# EAGLE design VNH7070AS test PCB (EAGLE 9.5.2)
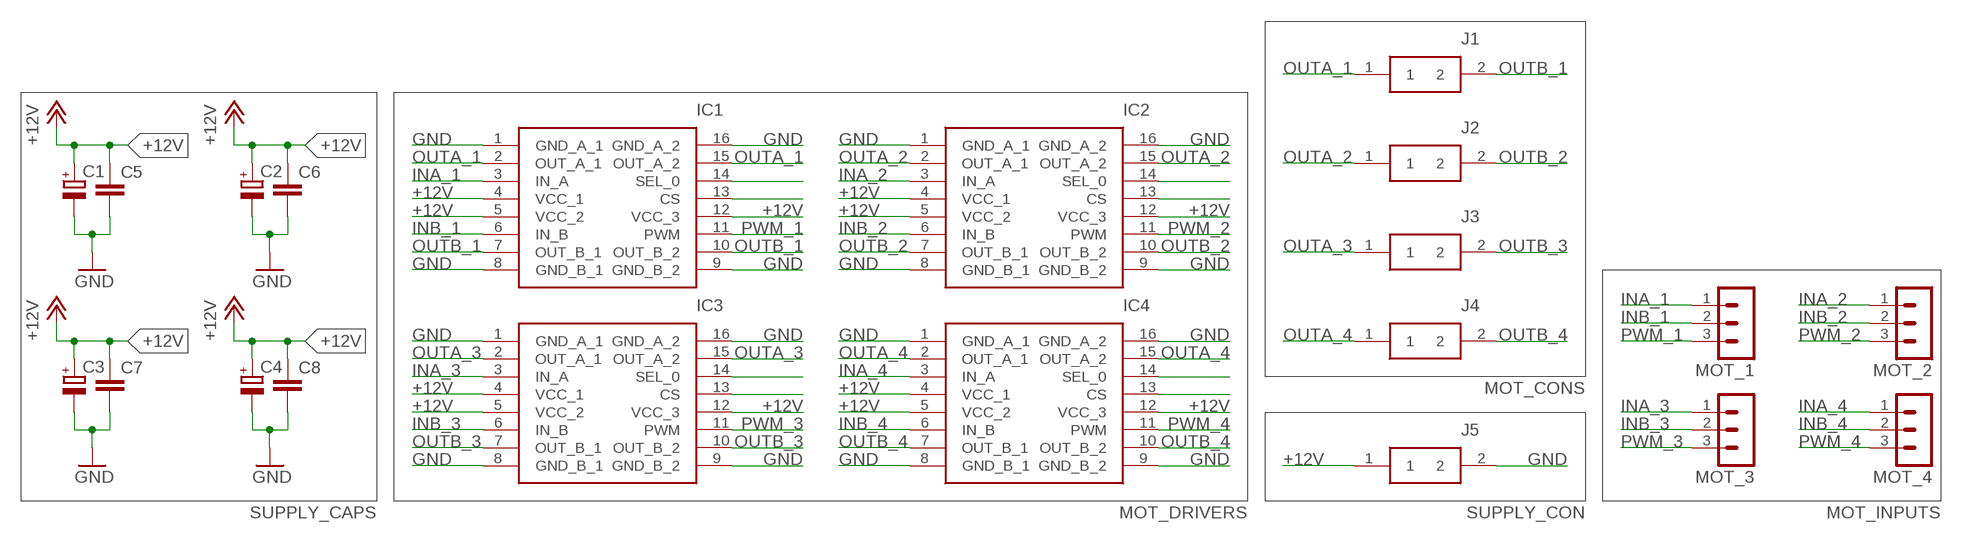
[diagram p0: schematic, sheet 1]

## Parts
C1  220uF  CPOL-EUE3.5-8  [E3,5-8]
C2  220uF  CPOL-EUE3.5-8  [E3,5-8]
C3  220uF  CPOL-EUE3.5-8  [E3,5-8]
C4  220uF  CPOL-EUE3.5-8  [E3,5-8]
C5  100nF  C-EUC1206  [C1206]
C6  100nF  C-EUC1206  [C1206]
C7  100nF  C-EUC1206  [C1206]
C8  100nF  C-EUC1206  [C1206]
IC1  VNH7070ASTR  [SOIC127P600X175-16N]
IC2  VNH7070ASTR  [SOIC127P600X175-16N]
IC3  VNH7070ASTR  [SOIC127P600X175-16N]
IC4  VNH7070ASTR  [SOIC127P600X175-16N]
J1  70553-0001  [SHDRRA2W109P0_254_1X2_762X1359]
J2  70553-0001  [SHDRRA2W109P0_254_1X2_762X1359]
J3  70553-0001  [SHDRRA2W109P0_254_1X2_762X1359]
J4  70553-0001  [SHDRRA2W109P0_254_1X2_762X1359]
J5  70553-0001  [SHDRRA2W109P0_254_1X2_762X1359]
MOT_1  MA03-1  [MA03-1]
MOT_2  MA03-1  [MA03-1]
MOT_3  MA03-1  [MA03-1]
MOT_4  MA03-1  [MA03-1]

## Nets
+12V: C1.+ C2.+ C3.+ C4.+ C5.1 C6.1 C7.1 C8.1 IC1.4(VCC_1) IC1.5(VCC_2) IC1.12(VCC_3) IC2.4(VCC_1) IC2.5(VCC_2) IC2.12(VCC_3) IC3.4(VCC_1) IC3.5(VCC_2) IC3.12(VCC_3) IC4.4(VCC_1) IC4.5(VCC_2) IC4.12(VCC_3) J5.1
GND: C1.- C2.- C3.- C4.- C5.2 C6.2 C7.2 C8.2 IC1.1(GND_A_1) IC1.8(GND_B_1) IC1.9(GND_B_2) IC1.16(GND_A_2) IC2.1(GND_A_1) IC2.8(GND_B_1) IC2.9(GND_B_2) IC2.16(GND_A_2) IC3.1(GND_A_1) IC3.8(GND_B_1) IC3.9(GND_B_2) IC3.16(GND_A_2) IC4.1(GND_A_1) IC4.8(GND_B_1) IC4.9(GND_B_2) IC4.16(GND_A_2) J5.2
INA_1: IC1.3(IN_A) MOT_1.1
INA_2: IC2.3(IN_A) MOT_2.1
INA_3: IC3.3(IN_A) MOT_3.1
INA_4: IC4.3(IN_A) MOT_4.1
INB_1: IC1.6(IN_B) MOT_1.2
INB_2: IC2.6(IN_B) MOT_2.2
INB_3: IC3.6(IN_B) MOT_3.2
INB_4: IC4.6(IN_B) MOT_4.2
N$1: IC1.14(SEL_0)
N$2: IC1.13(CS)
N$3: IC2.14(SEL_0)
N$4: IC2.13(CS)
N$5: IC3.14(SEL_0)
N$6: IC3.13(CS)
N$7: IC4.14(SEL_0)
N$8: IC4.13(CS)
OUTA_1: IC1.2(OUT_A_1) IC1.15(OUT_A_2) J1.1
OUTA_2: IC2.2(OUT_A_1) IC2.15(OUT_A_2) J2.1
OUTA_3: IC3.2(OUT_A_1) IC3.15(OUT_A_2) J3.1
OUTA_4: IC4.2(OUT_A_1) IC4.15(OUT_A_2) J4.1
OUTB_1: IC1.7(OUT_B_1) IC1.10(OUT_B_2) J1.2
OUTB_2: IC2.7(OUT_B_1) IC2.10(OUT_B_2) J2.2
OUTB_3: IC3.7(OUT_B_1) IC3.10(OUT_B_2) J3.2
OUTB_4: IC4.7(OUT_B_1) IC4.10(OUT_B_2) J4.2
PWM_1: IC1.11(PWM) MOT_1.3
PWM_2: IC2.11(PWM) MOT_2.3
PWM_3: IC3.11(PWM) MOT_3.3
PWM_4: IC4.11(PWM) MOT_4.3

## Notes on the sheet
- MOT_CONS
- SUPPLY_CAPS | MOT_DRIVERS | SUPPLY_CON | MOT_INPUTS

## Library data of the parts
C1-C4 = rcl:CPOL-EU: POLARIZED CAPACITOR, European symbol; SPICEPREFIX: C
C5-C8 = rcl:C-EU: CAPACITOR, European symbol; SPICEPREFIX: C
IC1-IC4 = VNH7070AS:VNH7070ASTR: Motor / Motion / Ignition Controllers & Drivers Source: Datasheet <http://www.st.com/content/ccc/resource/technical/document/datasheet/08/97/0a/0c/cf/4b/41/40/DM00213876.pdf/files/DM00213876.pdf/jcr:content/translations/en.DM00213876.pdf>; DESCRIPTION: Motor / Motion / Ignition Controllers & Drivers; HEIGHT: 1.75mm; MANUFACTURER_NAME: STMicroelectronics; MANUFACTURER_PART_NUMBER: VNH7070ASTR; MOUSER_PART_NUMBER: 511-VNH7070ASTR; MOUSER_PRICE-STOCK: https://www.mouser.com/Search/Refine.aspx?Keyword=511-VNH7070ASTR; RS_PART_NUMBER: 1647017P; RS_PRICE-STOCK: http://uk.rs-online.com/web/p/products/1647017P
J1-J5 = Molex 2pin SL:70553-0001: 2.54mm,housing,Cgrid,shrouded,90??,2w Molex SL Series, Series Number 70553, 2.54mm Pitch 2 Way 1 Row Right Angle PCB Header, Solder Termination, 3A Source: Datasheet <http://docs-emea.rs-online.com/webdocs/13c4/0900766b813c4970.pdf>; DESCRIPTION: 2.54mm,housing,Cgrid,shrouded,90??,2w Molex SL Series, Series Number 70553, 2.54mm Pitch 2 Way 1 Row Right Angle PCB Header, Solder Termination, 3A; HEIGHT: 6.99mm; MANUFACTURER_NAME: Molex; MANUFACTURER_PART_NUMBER: 70553-0001; MOUSER_PART_NUMBER: 538-70553-0001; MOUSER_PRICE-STOCK: https://www.mouser.com/Search/Refine.aspx?Keyword=538-70553-0001; RS_PART_NUMBER: 6792516P; RS_PRICE-STOCK: http://uk.rs-online.com/web/p/products/6792516P
MOT_1-MOT_4 = con-lstb:MA03-1: PIN HEADER; OC_FARNELL: unknown; OC_NEWARK: unknown

## Board
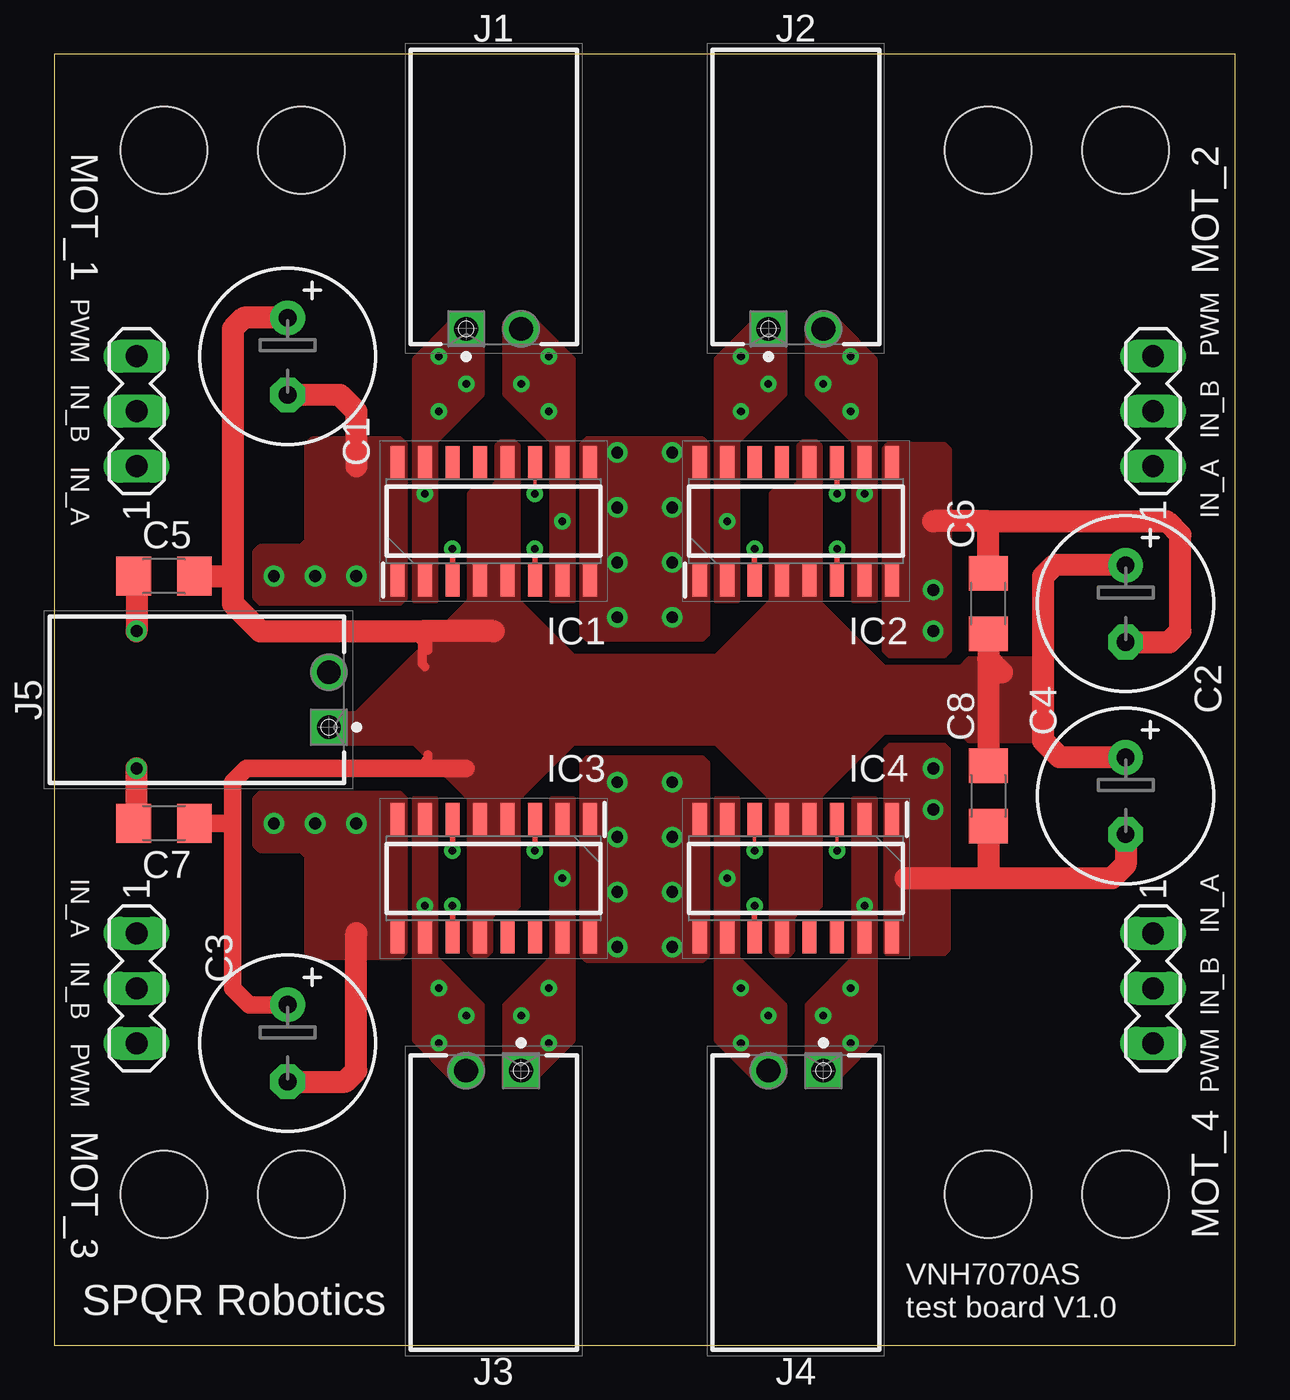
[diagram p1: board, top side]
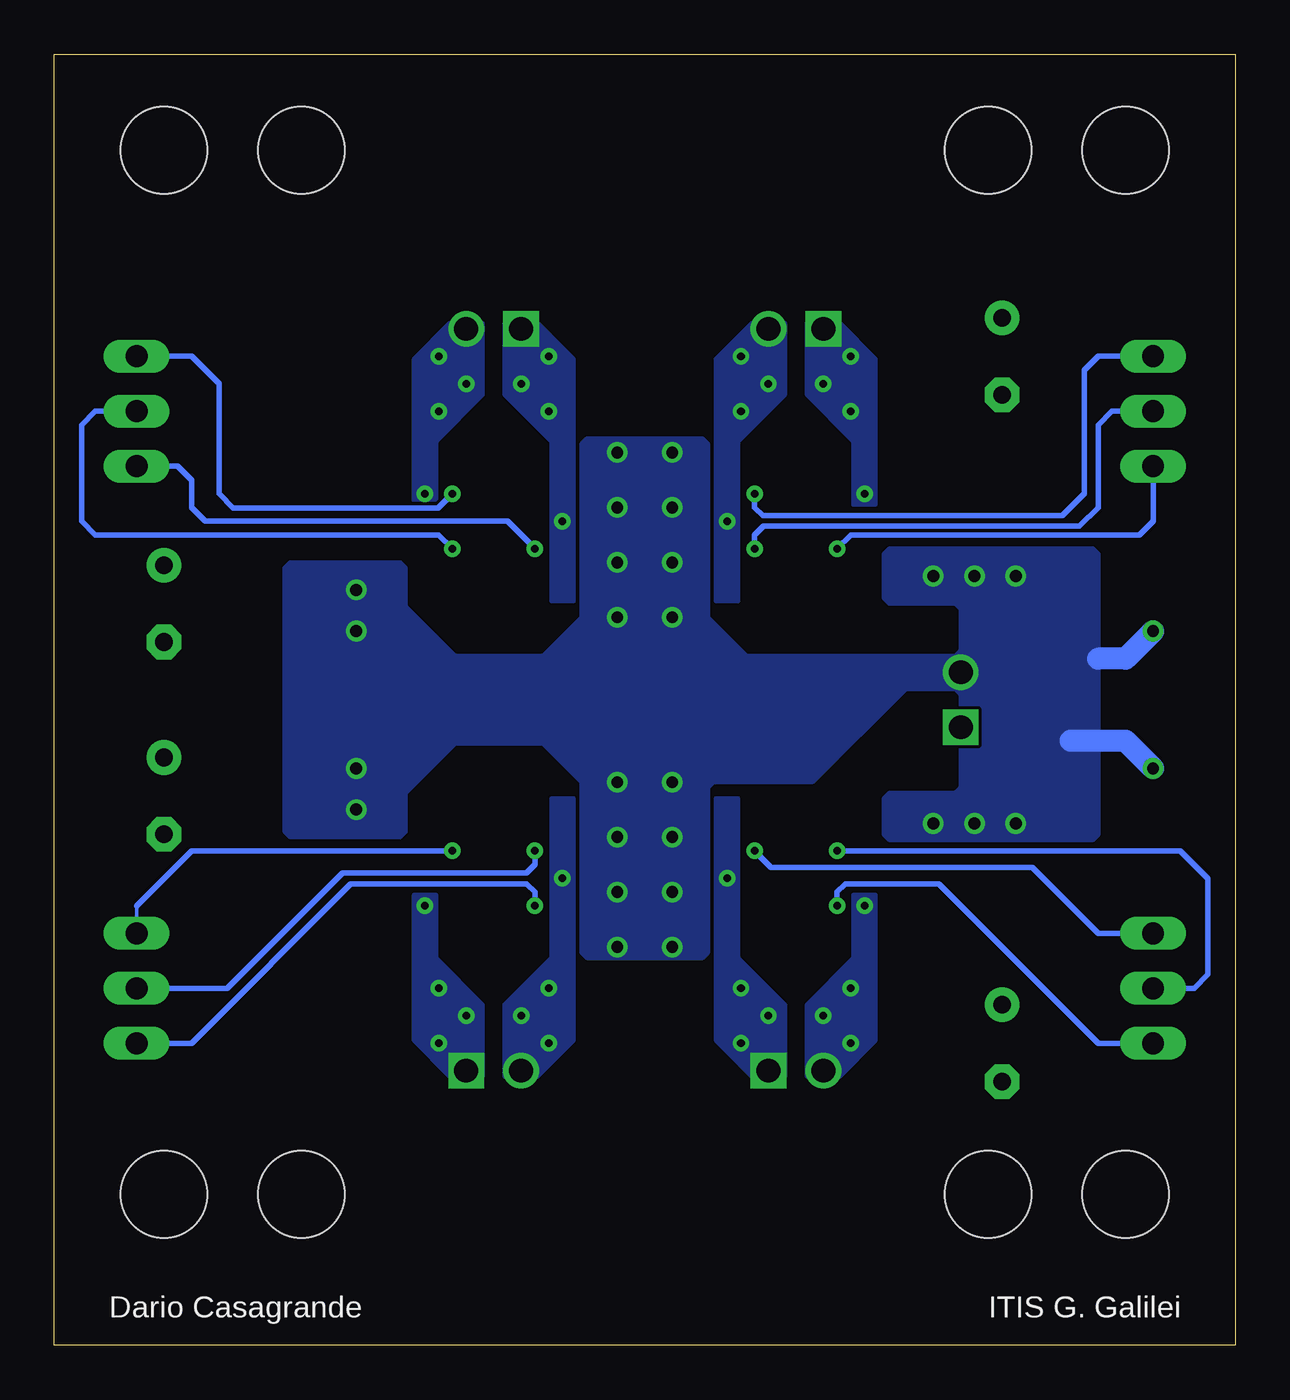
[diagram p2: board, bottom side, seen from below]

Size 54.61 x 59.69 mm. Coordinates in mm from the lower left corner, seen from the top.
Outline: 0,0 54.61,0 54.61,59.69 0,59.69 0,0
Copper layers (1*16): Top 0.035mm / dielectric 1.5mm / Bottom 0.035mm
Design rules "default *": minimum track width 6mil, minimum drill 0.35mm, track to track 6mil, track to pad 6mil, pad to pad 6mil, via to via 6mil, smd to smd 6mil, copper to edge 40mil, drill to drill 6mil, minimum pad ring 10mil, minimum via ring 8mil, stop-mask expansion 4mil, vias tented up to drill 14mil, thermal gap 10mil
Holes 4 mm at 5.08,55.24 11.43,55.24 43.18,55.24 49.53,55.24 49.53,6.99 43.18,6.99 5.08,6.99 11.43,6.99

### Footprints (pad centres in the part's own frame; a part is rotated, then mirrored left to right if it is on the bottom)
E3,5-8 = drill 0.813 pad 1.6: + -1.778,0 | drill 0.813 pad 1.6 octagon: - 1.778,0
C1206 = smd 1.6 x 1.8: 1 -1.4,0; 2 1.4,0
SOIC127P600X175-16N = smd 1.525 x 0.65: 1 -2.712,4.445; 2 -2.712,3.175; 3 -2.712,1.905; 4 -2.712,0.635; 5 -2.712,-0.635; 6 -2.712,-1.905; 7 -2.712,-3.175; 8 -2.712,-4.445; 9 2.712,-4.445; 10 2.712,-3.175; 11 2.712,-1.905; 12 2.712,-0.635; 13 2.712,0.635; 14 2.712,1.905; 15 2.712,3.175; 16 2.712,4.445
SHDRRA2W109P0_254_1X2_762X1359 = drill 1.1 pad 1.65 square: 1 0,0 | drill 1.1 pad 1.65: 2 -2.54,0
MA03-1 = drill 1.016 long: 1 -2.54,0; 2 0,0; 3 2.54,0

### Placement (x,y rotation side)
C1  10.79,45.72 270 top
C2  49.53,34.29 270 top
C3  10.79,13.97 270 top
C4  49.53,25.4 270 top
C5  5.08,35.56 180 top
C6  43.18,34.29 90 top
C7  5.08,24.13 180 top
C8  43.18,25.4 270 top
IC1  20.32,38.1 90 top
IC2  34.29,38.1 90 top
IC3  20.32,21.59 270 top
IC4  34.29,21.59 270 top
J1  19.05,46.99 180 top
J2  33.02,46.99 180 top
J3  21.59,12.7 0 top
J4  35.56,12.7 0 top
J5  12.7,28.57 270 top
MOT_1  3.81,43.18 90 top
MOT_2  50.8,43.18 90 top
MOT_3  3.81,16.51 270 top
MOT_4  50.8,16.51 270 top

### Tracks (layer width: path | path; a pad name or v marks a point on that pad's centre or on a via)
+12V
  Top 0.152: 16.89,26.67 16.89,26.92 17.27,27.3
  Top 0.406: 17.27,32.51 17.27,32.77 17.02,33.02 17.02,31.5 17.14,31.37 | 17.27,32.51 17.27,32.13 | 17.27,32.51 17.02,32.51 16.51,33.02 | 17.27,27.3 17.27,26.67
  Top 0.813: C3.+ 9.02,15.75 8.26,16.51 8.26,24.13 | 8.26,24.13 8.26,26.04 8.89,26.67 16.89,26.67 17.27,26.67 19.05,26.67 | C7.1 8.26,24.13
  Top 1.016: 8.26,35.56 8.26,34.29 9.53,33.02 16.51,33.02 17.02,33.02 20.32,33.02 | C5.1 8.26,35.56 | C1.+ 8.76,47.5 8.26,46.99 8.26,35.56 | C6.1 43.18,31.75 | 43.18,31.75 C8.1 | 43.81,31.11 43.18,31.75 | C2.+ 46.23,36.07 45.72,35.56 45.72,27.94 46.48,27.18 C4.+
  pour Top (no thermals): 11.94,28.96 12.19,29.21 13.97,29.21 19.18,34.42 19.18,39.37 19.43,39.62 20.19,39.62 20.45,39.88 20.45,41.59 20.64,41.78 21.27,41.78 21.46,41.59 21.46,34.42 24,31.88 30.61,31.88 33.15,34.42 33.15,39.37 33.4,39.62 34.16,39.62 34.42,39.88 34.42,41.59 34.61,41.78 35.24,41.78 35.43,41.59 35.43,34.29 38.35,31.37 41.91,31.37 42.29,31.75 45.85,31.75 46.1,31.5 46.1,28.19 45.85,27.94 42.29,27.94 41.91,28.32 38.35,28.32 35.43,25.4 35.43,20.32 35.18,20.07 34.42,20.07 34.16,19.81 34.16,18.22 33.97,18.03 33.34,18.03 33.15,18.22 33.15,25.27 30.61,27.81 24,27.81 21.46,25.27 21.46,20.32 21.21,20.07 20.45,20.07 20.19,19.81 20.19,18.22 20,18.03 19.37,18.03 19.18,18.22 19.18,25.27 16.64,27.81 12.19,27.81 11.94,28.07
GND  (via drill 0.55, 0.55 pad 0.55)
  Top 0.813: C7.2 3.81,24.26 | C5.2 3.81,35.43
  Top 1.016: C3.- 13.46,12.19 13.97,12.7 13.97,19.05 | 3.81,24.26 v3.81,26.67 | 3.81,35.43 v3.81,33.02 | 43.18,38.1 40.64,38.1 | C6.2 43.18,38.1 | C4.- 49.53,22.23 48.9,21.59 43.18,21.59 | C8.2 43.18,21.59 | 43.18,21.59 39.37,21.59 | 13.97,40.64 13.97,43.18 13.21,43.94 C1.- | 43.18,38.1 51.44,38.1 52.07,37.47 52.07,33.02 51.56,32.51 C2.-
  Bottom 1.016: v3.81,26.67 5.08,27.94 7.62,27.94 | v3.81,33.02 5.08,31.75 6.35,31.75
  other vias: 13.97,35.56 12.06,35.56 12.06,24.13 13.97,24.13 10.16,24.13 10.16,35.56 40.64,33.02 40.64,34.92 40.64,26.67 40.64,24.77 26.04,33.66 28.57,33.66 28.57,36.2 28.57,38.73 26.04,41.27 28.57,41.27 26.04,38.73 26.04,36.2 26.04,26.04 28.57,26.04 26.04,23.5 28.57,23.5 26.04,20.95 28.57,20.95 26.04,18.41 28.57,18.41
  pour Bottom (no thermals): 6.35,36.58 6.6,36.83 16,36.83 16.26,36.58 16.26,34.54 16,34.29 12.95,34.29 12.7,34.04 12.7,32.13 12.95,31.88 22.61,31.88 24.38,33.66 24.38,41.66 24.64,41.91 29.97,41.91 30.23,41.66 30.23,33.66 32,31.88 36.07,31.88 38.35,34.16 38.35,35.94 38.61,36.2 43.69,36.2 43.94,35.94 43.94,23.75 43.69,23.5 38.61,23.5 38.35,23.75 38.35,25.53 36.07,27.81 32,27.81 30.23,26.04 30.23,18.16 29.97,17.91 24.64,17.91 24.38,18.16 24.38,25.78 24.13,26.04 19.56,26.04 15.24,30.35 12.95,30.35 12.7,30.1 12.7,25.78 12.95,25.53 16,25.53 16.26,25.27 16.26,23.62 16,23.37 6.6,23.37 6.35,23.62
  pour Top (no thermals): 11.68,41.66 11.94,41.91 16,41.91 16.26,41.66 16.26,34.54 16,34.29 9.53,34.29 9.27,34.54 9.27,36.7 9.53,36.96 11.43,36.96 11.68,37.21
  pour Top (no thermals): 24.38,41.66 24.64,41.91 29.97,41.91 30.23,41.66 30.23,32.89 29.97,32.64 24.64,32.64 24.38,32.89
  pour Top (no thermals): 38.35,27.56 38.61,27.81 41.15,27.81 41.4,27.56 41.4,18.29 41.15,18.03 38.48,18.03 38.35,18.16
  pour Top (no thermals): 41.15,41.66 41.4,41.4 41.4,32.13 41.15,31.88 38.61,31.88 38.35,32.13 38.35,41.47 38.54,41.66
  pour Top (no thermals): 29.97,27.18 30.23,26.92 30.23,18.03 29.97,17.78 24.64,17.78 24.38,18.03 24.38,26.92 24.64,27.18
  pour Top (no thermals): 9.27,25.27 9.53,25.53 16,25.53 16.26,25.27 16.26,18.16 16,17.91 11.94,17.91 11.68,18.16 11.68,22.61 11.43,22.86 9.53,22.86 9.27,23.11
INA_1  (via drill 0.35)
  Top 0.254: IC1.3 v18.41,36.83
  Bottom 0.254: v18.41,36.83 17.78,37.47 4.45,37.47 3.81,38.1 MOT_1.1
INA_2  (via drill 0.35)
  Top 0.254: v32.38,36.83 IC2.3
  Bottom 0.254: MOT_2.1 48.9,40.64 48.26,40.01 48.26,38.73 47.62,38.1 33.66,38.1 v32.38,36.83
INA_3  (via drill 0.35)
  Top 0.254: IC3.3 v22.23,22.86
  Bottom 0.254: v22.23,22.86 21.46,22.1 9.4,22.1 6.35,19.05 MOT_3.1
INA_4  (via drill 0.35)
  Top 0.152: IC4.3 v36.2,22.86
  Bottom 0.152: 50.8,20.32 MOT_4.1
  Bottom 0.254: v36.2,22.86 48.26,22.86 50.8,20.32
INB_1  (via drill 0.35)
  Top 0.254: IC1.6 v22.23,36.83
  Bottom 0.254: MOT_1.2 5.71,43.18 6.35,42.55 6.35,38.73 7.21,37.87 21.82,37.87 22.23,37.47 v22.23,36.83
INB_2  (via drill 0.35)
  Top 0.254: IC2.6 v36.2,36.83
  Bottom 0.254: MOT_2.2 52.7,43.18 53.34,42.55 53.34,38.1 52.7,37.47 36.83,37.47 v36.2,36.83
INB_3  (via drill 0.35)
  Top 0.254: IC3.6 v18.41,22.86
  Bottom 0.254: MOT_3.2 1.91,16.51 1.27,17.14 1.27,21.59 2.54,22.86 v18.41,22.86
INB_4  (via drill 0.35)
  Top 0.152: IC4.6 v32.38,22.86
  Bottom 0.254: v32.38,22.86 32.38,22.23 32.77,21.84 41.27,21.84 46.61,16.51 MOT_4.2
OUTA_1  (via drill 0.35)
  other vias: 17.78,45.72 19.05,44.45 17.78,43.18 17.14,39.37
  pour Bottom (no thermals): 17.65,38.86 16.64,38.86 16.64,45.59 18.29,47.24 19.81,47.24 19.81,43.94 17.65,41.78
  pour Top (no thermals): 19.81,47.24 18.29,47.24 16.64,45.59 16.64,34.42 17.65,34.42 17.65,41.78 19.81,43.94
OUTA_2  (via drill 0.35)
  other vias: 31.75,45.72 33.02,44.45 31.75,43.18 31.11,38.1
  pour Bottom (no thermals): 31.62,34.42 30.61,34.42 30.61,45.59 32.26,47.24 33.78,47.24 33.78,43.94 31.62,41.78
  pour Top (no thermals): 33.78,47.24 32.26,47.24 30.61,45.59 30.61,34.42 31.62,34.42 31.62,41.78 33.78,43.94
OUTA_3  (via drill 0.35)
  other vias: 22.86,13.97 21.59,15.24 22.86,16.51 23.5,21.59
  pour Top (no thermals): 22.99,25.27 24,25.27 24,14.1 22.35,12.45 20.83,12.45 20.83,15.75 22.99,17.91
  pour Bottom (no thermals): 22.99,25.27 24,25.27 24,14.1 22.35,12.45 20.83,12.45 20.83,15.75 22.99,17.91
OUTA_4  (via drill 0.35)
  other vias: 36.83,13.97 35.56,15.24 36.83,16.51 37.47,20.32
  pour Top (no thermals): 36.96,25.27 37.97,25.27 37.97,14.1 36.32,12.45 34.8,12.45 34.8,15.75 36.96,17.91
  pour Bottom (no thermals): 36.96,20.83 37.97,20.83 37.97,14.1 36.32,12.45 34.8,12.45 34.8,15.75 36.96,17.91
OUTB_1  (via drill 0.35)
  other vias: 22.86,45.72 21.59,44.45 22.86,43.18 23.5,38.1
  pour Top (no thermals): 22.99,34.42 24,34.42 24,45.59 22.35,47.24 20.83,47.24 20.83,43.94 22.99,41.78
  pour Bottom (no thermals): 20.83,47.24 22.35,47.24 24,45.59 24,34.42 22.99,34.42 22.99,41.78 20.83,43.94
OUTB_2  (via drill 0.35)
  other vias: 36.83,45.72 35.56,44.45 36.83,43.18 37.47,39.37
  pour Top (no thermals): 36.96,34.42 37.97,34.42 37.97,45.59 36.32,47.24 34.8,47.24 34.8,43.94 36.96,41.78
  pour Bottom (no thermals): 34.8,47.24 36.32,47.24 37.97,45.59 37.97,38.73 36.96,38.73 36.96,41.78 34.8,43.94
OUTB_3  (via drill 0.35)
  other vias: 17.78,13.97 19.05,15.24 17.78,16.51 17.14,20.32
  pour Top (no thermals): 16.64,25.27 17.65,25.27 17.65,17.91 19.81,15.75 19.81,12.45 18.29,12.45 16.64,14.1
  pour Bottom (no thermals): 16.64,20.83 17.65,20.83 17.65,17.91 19.81,15.75 19.81,12.45 18.29,12.45 16.64,14.1
OUTB_4  (via drill 0.35)
  other vias: 31.11,21.59 31.75,16.51 31.75,13.97 33.02,15.24
  pour Bottom (no thermals): 30.61,25.27 31.62,25.27 31.62,17.91 33.78,15.75 33.78,12.45 32.26,12.45 30.61,14.1
  pour Top (no thermals): 30.61,25.27 31.62,25.27 31.62,17.91 33.78,15.75 33.78,12.45 32.26,12.45 30.61,14.1
PWM_1  (via drill 0.35)
  Top 0.152: IC1.11 v22.23,39.37
  Bottom 0.254: MOT_1.3 6.35,45.72 6.99,45.09 6.99,39.37 8,38.35 21.84,38.35 22.23,38.73 v22.23,39.37
PWM_2  (via drill 0.35)
  Top 0.254: IC2.11 v36.2,39.37
  Bottom 0.254: MOT_2.3 48.26,45.72 46.99,44.45 46.99,39.37 46.33,38.71 36.85,38.71 v36.2,39.37
PWM_3  (via drill 0.35)
  Top 0.254: IC3.11 v18.41,20.32
  Bottom 0.254: v18.41,20.32 18.41,20.95 18.03,21.34 13.72,21.34 6.35,13.97 MOT_3.3
PWM_4  (via drill 0.35)
  Top 0.254: IC4.11 v32.38,20.32
  Bottom 0.254: MOT_4.3 48.26,13.97 40.89,21.34 32.77,21.34 32.38,20.95 v32.38,20.32

### Text on the board
tNames: PWM | PWM | IN_B | IN_B | IN_A | IN_A | IN_A | IN_A | IN_B | IN_B | PWM | PWM | VNH7070AS | SPQR Robotics | test board V1.0
bNames: ITIS G. Galilei | Dario Casagrande